# Altium schematic sheet BANK502.SchDoc
size A4; SheetNumber: 6; SheetTotal: 13
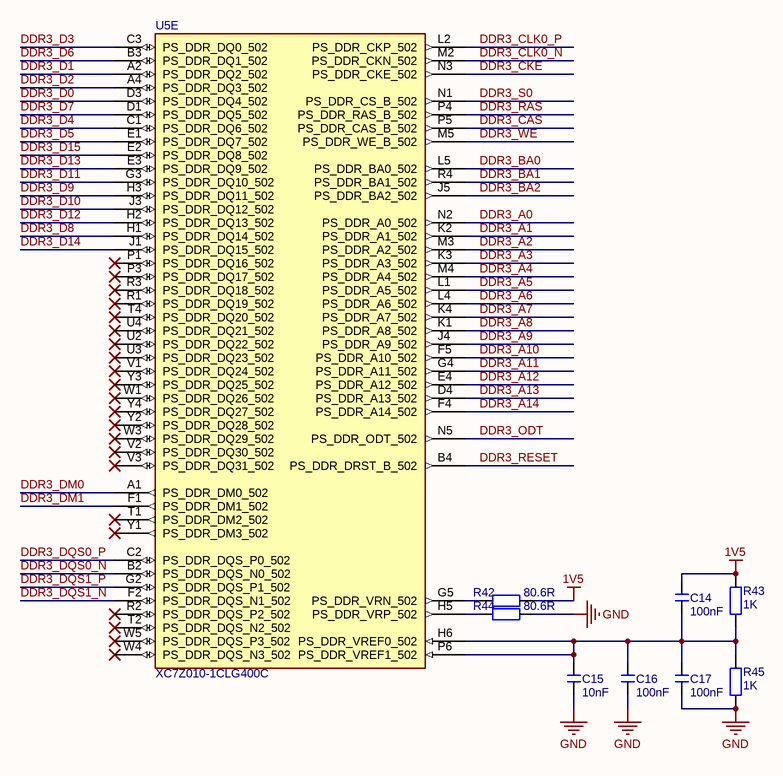
[diagram p0: BANK502.SchDoc]

## Parts
C14  100nF  [C 0402_L]
C15  10nF  [C 0402_L]
C16  100nF  [C 0402_L]
C17  100nF  [C 0402_L]
R42  80.6R  [R 0805_L]
R43  1K  [R 0402_L]
R44  80.6R  [R 0805_L]
R45  1K  [R 0402_L]
U5  XC7Z010-1CLG400C  [CLG400]  (part E of 9)

## Nets
1V5: C14.2 R42.2 R43.1
GND: C15.1 C16.1 C17.1 R44.2 R45.2
DDR3_A0: U5.N2(PS_DDR_A0_502)
DDR3_A1: U5.K2(PS_DDR_A1_502)
DDR3_A2: U5.M3(PS_DDR_A2_502)
DDR3_A3: U5.K3(PS_DDR_A3_502)
DDR3_A4: U5.M4(PS_DDR_A4_502)
DDR3_A5: U5.L1(PS_DDR_A5_502)
DDR3_A6: U5.L4(PS_DDR_A6_502)
DDR3_A7: U5.K4(PS_DDR_A7_502)
DDR3_A8: U5.K1(PS_DDR_A8_502)
DDR3_A9: U5.J4(PS_DDR_A9_502)
DDR3_A10: U5.F5(PS_DDR_A10_502)
DDR3_A11: U5.G4(PS_DDR_A11_502)
DDR3_A12: U5.E4(PS_DDR_A12_502)
DDR3_A13: U5.D4(PS_DDR_A13_502)
DDR3_A14: U5.F4(PS_DDR_A14_502)
DDR3_BA0: U5.L5(PS_DDR_BA0_502)
DDR3_BA1: U5.R4(PS_DDR_BA1_502)
DDR3_BA2: U5.J5(PS_DDR_BA2_502)
DDR3_CAS: U5.P5(PS_DDR_CAS_B_502)
DDR3_CKE: U5.N3(PS_DDR_CKE_502)
DDR3_CLK0_N: U5.M2(PS_DDR_CKN_502)
DDR3_CLK0_P: U5.L2(PS_DDR_CKP_502)
DDR3_D0: U5.D3(PS_DDR_DQ4_502)
DDR3_D1: U5.A2(PS_DDR_DQ2_502)
DDR3_D2: U5.A4(PS_DDR_DQ3_502)
DDR3_D3: U5.C3(PS_DDR_DQ0_502)
DDR3_D4: U5.C1(PS_DDR_DQ6_502)
DDR3_D5: U5.E1(PS_DDR_DQ7_502)
DDR3_D6: U5.B3(PS_DDR_DQ1_502)
DDR3_D7: U5.D1(PS_DDR_DQ5_502)
DDR3_D8: U5.H1(PS_DDR_DQ14_502)
DDR3_D9: U5.H3(PS_DDR_DQ11_502)
DDR3_D10: U5.J3(PS_DDR_DQ12_502)
DDR3_D11: U5.G3(PS_DDR_DQ10_502)
DDR3_D12: U5.H2(PS_DDR_DQ13_502)
DDR3_D13: U5.E3(PS_DDR_DQ9_502)
DDR3_D14: U5.J1(PS_DDR_DQ15_502)
DDR3_D15: U5.E2(PS_DDR_DQ8_502)
DDR3_DM0: U5.A1(PS_DDR_DM0_502)
DDR3_DM1: U5.F1(PS_DDR_DM1_502)
DDR3_DQS0_N: U5.B2(PS_DDR_DQS_N0_502)
DDR3_DQS0_P: U5.C2(PS_DDR_DQS_P0_502)
DDR3_DQS1_N: U5.F2(PS_DDR_DQS_N1_502)
DDR3_DQS1_P: U5.G2(PS_DDR_DQS_P1_502)
DDR3_ODT: U5.N5(PS_DDR_ODT_502)
DDR3_RAS: U5.P4(PS_DDR_RAS_B_502)
DDR3_RESET: U5.B4(PS_DDR_DRST_B_502)
DDR3_S0: U5.N1(PS_DDR_CS_B_502)
DDR3_WE: U5.M5(PS_DDR_WE_B_502)
NetC14_1: C14.1 C15.2 C16.2 C17.2 R43.2 R45.1 U5.H6(PS_DDR_VREF0_502) U5.P6(PS_DDR_VREF1_502)
NetR42_1: R42.1 U5.G5(PS_DDR_VRN_502)
NetR44_1: R44.1 U5.H5(PS_DDR_VRP_502)

Not connected (* = marked no-connect by the designer): U5 P1(PS_DDR_DQ16_502)* P3(PS_DDR_DQ17_502)* R1(PS_DDR_DQ19_502)* R2(PS_DDR_DQS_P2_502)* R3(PS_DDR_DQ18_502)* T1(PS_DDR_DM2_502)* T2(PS_DDR_DQS_N2_502)* T4(PS_DDR_DQ20_502)* U2(PS_DDR_DQ22_502)* U3(PS_DDR_DQ23_502)* U4(PS_DDR_DQ21_502)* V1(PS_DDR_DQ24_502)* V2(PS_DDR_DQ30_502)* V3(PS_DDR_DQ31_502)* W1(PS_DDR_DQ26_502)* W3(PS_DDR_DQ29_502)* W4(PS_DDR_DQS_N3_502)* W5(PS_DDR_DQS_P3_502)* Y1(PS_DDR_DM3_502)* Y2(PS_DDR_DQ28_502)* Y3(PS_DDR_DQ25_502)* Y4(PS_DDR_DQ27_502)*

## Library data of the parts
C14-C17 = C: 无极性贴片电容; 版权归属: 源创客; BOM名称: 无极性贴片电容; 学习资源: www.ooocke.com
R42-R45 = R: 贴片电阻; 版权归属: 源创客; BOM名称: 贴片电阻; 学习资源: www.ooocke.com
U5 = XC7Z010-1CLG400C: ZYNQ7000芯片